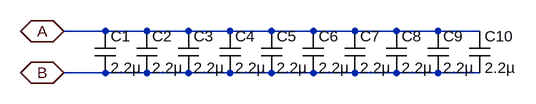
[diagram p0: schematic FL2.asc]
FL2.asc, the LTspice schematic file:
Version 4.1
SHEET 1 880 680
WIRE 128 96 64 96
WIRE 192 96 128 96
WIRE 256 96 192 96
WIRE 320 96 256 96
WIRE 384 96 320 96
WIRE 448 96 384 96
WIRE 512 96 448 96
WIRE 576 96 512 96
WIRE 640 96 576 96
WIRE 704 96 640 96
WIRE 128 160 64 160
WIRE 192 160 128 160
WIRE 256 160 192 160
WIRE 320 160 256 160
WIRE 384 160 320 160
WIRE 448 160 384 160
WIRE 512 160 448 160
WIRE 576 160 512 160
WIRE 640 160 576 160
WIRE 704 160 640 160
FLAG 64 96 A
IOPIN 64 96 BiDir
FLAG 64 160 B
IOPIN 64 160 BiDir
SYMBOL cap 112 96 R0
SYMATTR InstName C1
SYMATTR Value 2.2µ
SYMATTR SpiceLine V=450 Rser=0.0043 Lser=0.65n Rpar=0.227G
SYMBOL cap 176 96 R0
SYMATTR InstName C2
SYMATTR Value 2.2µ
SYMATTR SpiceLine V=450 Rser=0.0043 Lser=0.65n Rpar=0.227G
SYMBOL cap 240 96 R0
SYMATTR InstName C3
SYMATTR Value 2.2µ
SYMATTR SpiceLine V=450 Rser=0.0043 Lser=0.65n Rpar=0.227G
SYMBOL cap 304 96 R0
SYMATTR InstName C4
SYMATTR Value 2.2µ
SYMATTR SpiceLine V=450 Rser=0.0043 Lser=0.65n Rpar=0.227G
SYMBOL cap 368 96 R0
SYMATTR InstName C5
SYMATTR Value 2.2µ
SYMATTR SpiceLine V=450 Rser=0.0043 Lser=0.65n Rpar=0.227G
SYMBOL cap 432 96 R0
SYMATTR InstName C6
SYMATTR Value 2.2µ
SYMATTR SpiceLine V=450 Rser=0.0043 Lser=0.65n Rpar=0.227G
SYMBOL cap 496 96 R0
SYMATTR InstName C7
SYMATTR Value 2.2µ
SYMATTR SpiceLine V=450 Rser=0.0043 Lser=0.65n Rpar=0.227G
SYMBOL cap 560 96 R0
SYMATTR InstName C8
SYMATTR Value 2.2µ
SYMATTR SpiceLine V=450 Rser=0.0043 Lser=0.65n Rpar=0.227G
SYMBOL cap 624 96 R0
SYMATTR InstName C9
SYMATTR Value 2.2µ
SYMATTR SpiceLine V=450 Rser=0.0043 Lser=0.65n Rpar=0.227G
SYMBOL cap 688 96 R0
SYMATTR InstName C10
SYMATTR Value 2.2µ
SYMATTR SpiceLine V=450 Rser=0.0043 Lser=0.65n Rpar=0.227G

The netlist it stands for:
* FL2.asc
C1 A B 2.2µ V=450 Rser=0.0043 Lser=0.65n Rpar=0.227G
C2 A B 2.2µ V=450 Rser=0.0043 Lser=0.65n Rpar=0.227G
C3 A B 2.2µ V=450 Rser=0.0043 Lser=0.65n Rpar=0.227G
C4 A B 2.2µ V=450 Rser=0.0043 Lser=0.65n Rpar=0.227G
C5 A B 2.2µ V=450 Rser=0.0043 Lser=0.65n Rpar=0.227G
C6 A B 2.2µ V=450 Rser=0.0043 Lser=0.65n Rpar=0.227G
C7 A B 2.2µ V=450 Rser=0.0043 Lser=0.65n Rpar=0.227G
C8 A B 2.2µ V=450 Rser=0.0043 Lser=0.65n Rpar=0.227G
C9 A B 2.2µ V=450 Rser=0.0043 Lser=0.65n Rpar=0.227G
C10 A B 2.2µ V=450 Rser=0.0043 Lser=0.65n Rpar=0.227G
.backanno
.end